# Altium schematic sheet eCore_Power.SchDoc
size A
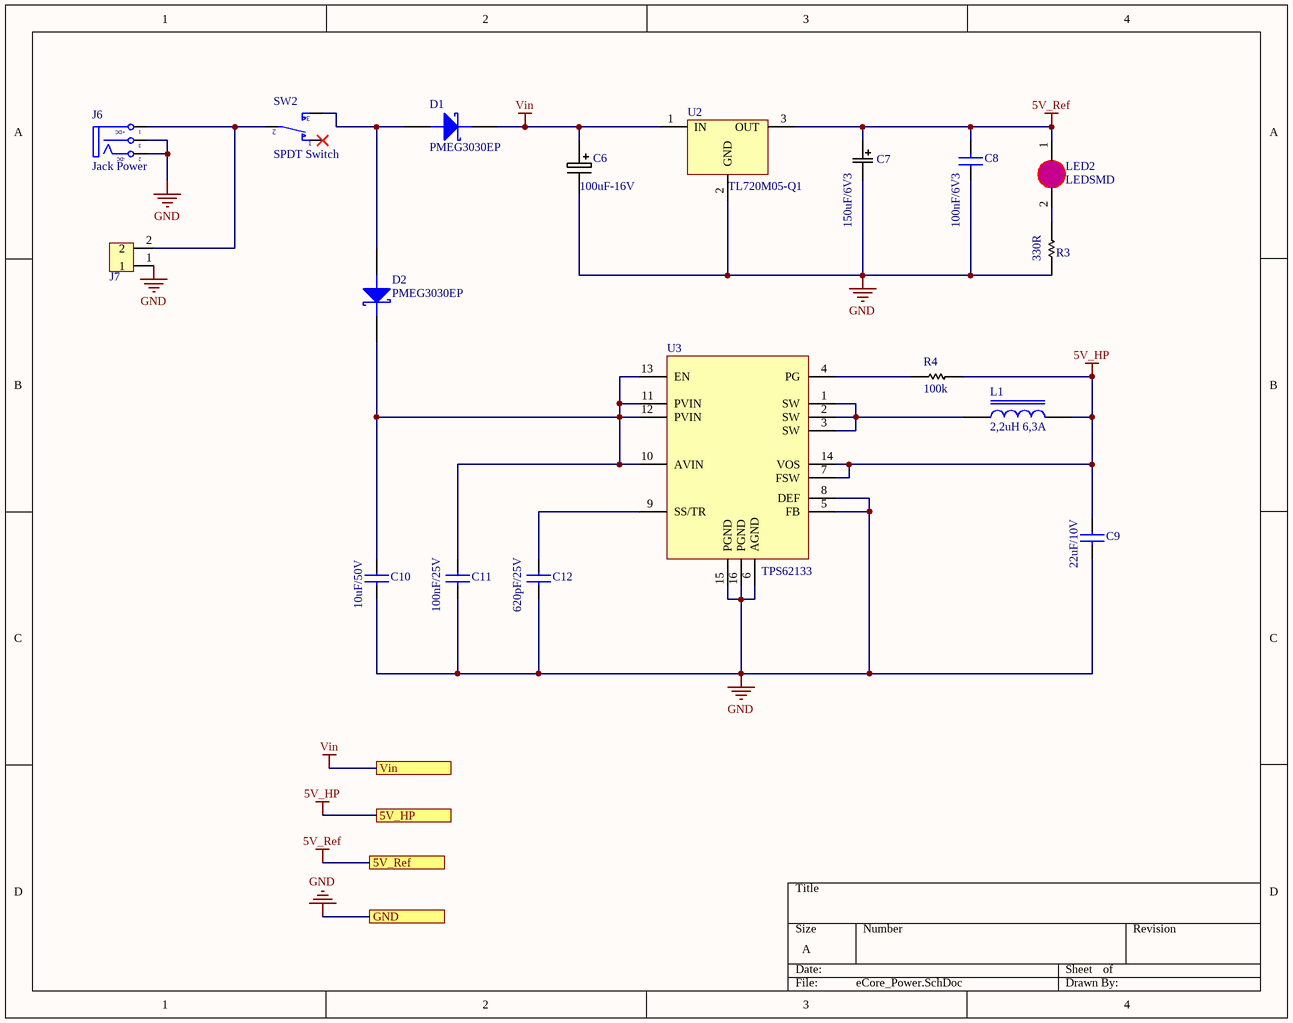
[diagram p0: eCore_Power.SchDoc]

## Parts
C6  100uF-16V  [PANACAP-D-GENERIC]
C7  150uF/6V3  [CASE_B_3528_1411]
C8  100nF/6V3  [CAPC1005X60N]
C9  22uF/10V  [C1206]
C10  10uF/50V  [C1206]
C11  100nF/25V  [C0603]
C12  620pF/25V  [C0603]
D1  PMEG3030EP  [SOD128]
D2  PMEG3030EP  [SOD128]
J6  Jack Power  [DC-IN]
J7  Header 2x1  [2P ZH1.5MM]  (value not drawn)
L1  2,2uH 6,3A  [SRN8040]
LED2  LEDSMD  [LEDR-0402]
R3  330R  [RES 0402 SMD]
R4  100k  [RES 0402 SMD]
SW2  SPDT Switch  [Slide Switch SPDT]
U2  TL720M05-Q1  [TO-252]
U3  TPS62133  [QFN16]

## Ports
5V_HP, 5V_Ref, GND, Vin

## Nets
5V_HP: C9.1 L1.2 R4.1 U3.7(FSW) U3.14(VOS) ; port 5V_HP
5V_Ref: C7.1(C1) C8.2 LED2.1(A) U2.3(OUT) ; port 5V_Ref
GND: C6.- C7.2(C2) C8.1 C9.2 C10.2 C11.2 C12.2 J6.2(TN) J6.3(S) J7.1 R3.2 U2.2(GND) U3.5(FB) U3.6(AGND) U3.8(DEF) U3.15(PGND) U3.16(PGND) ; port GND
Vin: C6.+ D1.K U2.1(IN) ; port Vin
NetC10_1: C10.1 C11.1 D2.K U3.10(AVIN) U3.11(PVIN) U3.12(PVIN) U3.13(EN)
NetC12_1: C12.1 U3.9(SS/TR)
NetD1_A: D1.A D2.A SW2.3
NetJ6_1: J6.1(T) J7.2 SW2.2
NetL1_1: L1.1 U3.1(SW) U3.2(SW) U3.3(SW)
NetLED2_2: LED2.2(K) R3.1
NetR4_2: R4.2 U3.4(PG)

Not connected (* = marked no-connect by the designer): SW2 1*

## Notes on the sheet
- (in symbol Jack Power) +DC; -DC

## Library data of the parts
C6 = PANACAP-100UF-16V-FK: GENERIC CAPACITOR POLARISED; Supplier 1: Digi-Key; Supplier Part Number 1: PCE3783TR-ND
C7 = Cap CASE B
C8 = Cap 0402
C9 C10 = Cap 1206: Right: 20; Bottom: 10
C11 C12 = Cap 0603: Right: 20; Bottom: 10
J6 = Jack Power: Jac DC input; Value: Jac DC
L1 = Inductor SMD
LED2 = LEDSMD: LED 3mm
R3 R4 = Res 0402: Resistor; Manufacturer: Generic Components; Class: Passive; Published: 08/06/2000; Publisher: Altium Hobart Technology Centre; SubClass: Resistor